# EAGLE design Schaltplan (EAGLE 6.6.0)
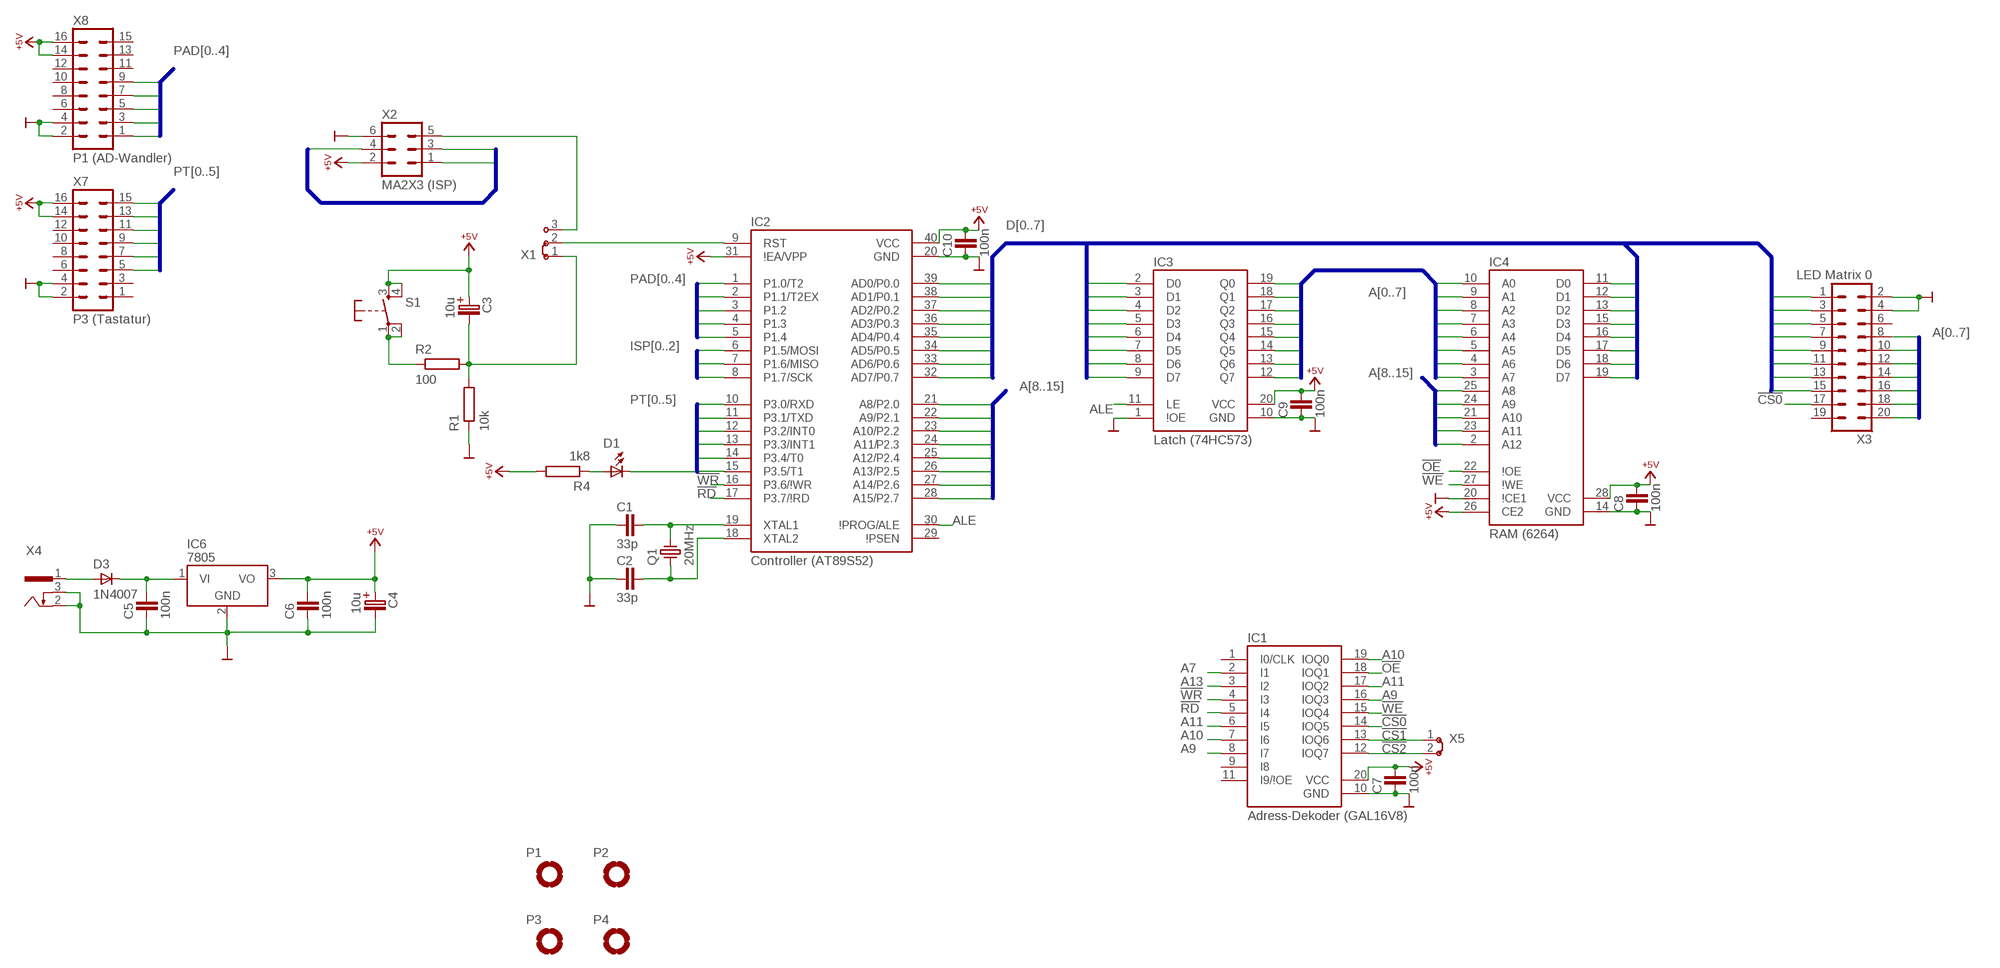
[diagram p0: schematic, sheet 1]

## Parts
C1  33p  C-2,5  [C-2,5]
C2  33p  C-2,5  [C-2,5]
C3  10u  ELKO-2,5  [ELKO-2,5]
C4  10u  ELKO-2,5  [ELKO-2,5]
C5  100n  C-2,5  [C-2,5]
C6  100n  C-2,5  [C-2,5]
C7  100n  C-2,5  [C-2,5]
C8  100n  C-2,5  [C-2,5]
C9  100n  C-2,5  [C-2,5]
C10  100n  C-2,5  [C-2,5]
D1  LED3-2,5  [LED3-2,5]
D3  1N4007  1N4007-10  [DO41-10]
IC1  Adress-Dekoder (GAL16V8)  16V8  [DIL20]
IC2  Controller (AT89S52)  AT89S52  [DIL40]
IC3  Latch (74HC573)  74573  [DIL20]
IC4  RAM (6264)  6264  [DIL28]
IC6  7805  [TO220V]
P1  MPAD-3,0  [MPAD-3,0]
P2  MPAD-3,0  [MPAD-3,0]
P3  MPAD-3,0  [MPAD-3,0]
P4  MPAD-3,0  [MPAD-3,0]
Q1  20MHz  Q-HC49U  [HC49U]
R1  10k  R-10  [R-10]
R2  100  R-10  [R-10]
R4  1k8  R-10  [R-10]
S1  KEY-3301  [T3301]
X1  J1X3  [J1X3]
X2  MA2X3 (ISP)  MA3X2  [MA3X2]
X3  LED Matrix 0  MA10X2  [MA10X2]
X4  PWRCON-HEBW21  [HEBW21]
X5  J1X2  [J1X2]
X7  P3 (Tastatur)  MA8X2  [MA8X2]
X8  P1 (AD-Wandler)  MA8X2  [MA8X2]

## Nets
!CS0: IC1.14(IOQ5) X3.17
!CS1: IC1.13(IOQ6) X5.1
!CS2: IC1.12(IOQ7) X5.2
!OE: IC1.18(IOQ1) IC4.22(\!OE)
!RD: IC1.5(I4) IC2.17(P3.7)
!WE: IC1.15(IOQ4) IC4.27(\!WE)
!WR: IC1.4(I3) IC2.16(P3.6)
+5V: C3.+ C4.+ C6.2 C7.2 C8.2 C9.2 C10.2 IC1.20(VCC) IC2.31(\!EA) IC2.40(VCC) IC3.20(VCC) IC4.26(CE2) IC4.28(VCC) IC6.3(VO) R4.2 S1.3(S) S1.4(S) X2.2 X7.14 X7.16 X8.14 X8.16
A0: IC3.19(Q0) IC4.10(A0) X3.8
A1: IC3.18(Q1) IC4.9(A1) X3.10
A2: IC3.17(Q2) IC4.8(A2) X3.12
A3: IC3.16(Q3) IC4.7(A3) X3.14
A4: IC3.15(Q4) IC4.6(A4) X3.16
A5: IC3.14(Q5) IC4.5(A5) X3.18
A6: IC3.13(Q6) IC4.4(A6) X3.20
A7: IC1.2(I1) IC3.12(Q7) IC4.3(A7)
A8: IC2.21(P2.0) IC4.25(A8)
A9: IC1.8(I7) IC1.16(IOQ3) IC2.22(P2.1) IC4.24(A9)
A10: IC1.7(I6) IC1.19(IOQ0) IC2.23(P2.2) IC4.21(A10)
A11: IC1.6(I5) IC1.17(IOQ2) IC2.24(P2.3) IC4.23(A11)
A12: IC2.25(P2.4) IC4.2(A12)
A13: IC1.3(I2) IC2.26(P2.5)
A14: IC2.27(P2.6)
A15: IC2.28(P2.7)
ALE: IC2.30(ALE) IC3.11(LE)
D0: IC2.39(P0.0) IC3.2(D0) IC4.11(D0) X3.1
D1: IC2.38(P0.1) IC3.3(D1) IC4.12(D1) X3.3
D2: IC2.37(P0.2) IC3.4(D2) IC4.13(D2) X3.5
D3: IC2.36(P0.3) IC3.5(D3) IC4.15(D3) X3.7
D4: IC2.35(P0.4) IC3.6(D4) IC4.16(D4) X3.9
D5: IC2.34(P0.5) IC3.7(D5) IC4.17(D5) X3.11
D6: IC2.33(P0.6) IC3.8(D6) IC4.18(D6) X3.13
D7: IC2.32(P0.7) IC3.9(D7) IC4.19(D7) X3.15
GND: C1.1 C2.1 C4.- C5.1 C6.1 C7.1 C8.1 C9.1 C10.1 IC1.10(GND) IC2.20(GND) IC3.1(\!OE) IC3.10(GND) IC4.14(GND) IC4.20(\!CE1) IC6.2(GND) R1.1 X2.6 X3.2 X3.4 X4.2 X4.3 X7.2 X7.4 X8.2 X8.4
ISP0: IC2.6(P1.5) X2.4
ISP1: IC2.7(P1.6) X2.1
ISP2: IC2.8(P1.7) X2.3
N$1: D1.A R4.1
N$8: IC2.9(RST) X1.2
N$9: C1.2 IC2.19(XTAL1) Q1.2
N$10: C2.2 IC2.18(XTAL2) Q1.1
N$12: D3.A X4.1
N$13: C5.2 D3.C IC6.1(VI)
N$15: X1.3 X2.5
N$16: C3.- R1.2 R2.2 X1.1
N$18: R2.1 S1.1(P) S1.2(P)
PAD0: IC2.1(P1.0) X8.9
PAD1: IC2.2(P1.1) X8.7
PAD2: IC2.3(P1.2) X8.5
PAD3: IC2.4(P1.3) X8.3
PAD4: IC2.5(P1.4) X8.1
PT0: IC2.10(P3.0) X7.15
PT1: IC2.11(P3.1) X7.13
PT2: IC2.12(P3.2) X7.11
PT3: IC2.13(P3.3) X7.9
PT4: IC2.14(P3.4) X7.7
PT5: D1.C IC2.15(P3.5) X7.5
Unconnected: IC1.1(I0/CLK) IC1.9(I8) IC1.11(I9/\!OE) IC2.29(\!PSEN) P1.B3,0(MOUNT) P2.B3,0(MOUNT) P3.B3,0(MOUNT) P4.B3,0(MOUNT) X3.6 X3.19 X7.1 X7.3 X7.6 X7.8 X7.10 X7.12 X8.6 X8.8 X8.10 X8.11 X8.12 X8.13 X8.15

## Buses
A[0..7]
A[8..15]
D[0..7]
PAD[0..4]
PT[0..5]
ISP[0..2]

## Library data of the parts
C1 C2 C5-C10 = 89S52mini:C-2,5
C3 C4 = 89S52mini:ELKO-2,5
D1 = 89S52mini:LED3-2,5
D3 = 89S52mini:1N4007-10
IC1 = 89S52mini:16V8
IC2 = 89S52mini:AT89S52
IC3 = 89S52mini:74573
IC4 = 89S52mini:6264
IC6 = 89S52mini:7805
P1-P4 = 89S52mini:MPAD-3,0
Q1 = 89S52mini:Q-HC49U
R1 R2 R4 = 89S52mini:R-10
S1 = 89S52mini:KEY-3301
X1 = 89S52mini:J1X3
X2 = 89S52mini:MA3X2
X3 = 89S52mini:MA10X2
X4 = 89S52mini:PWRCON-HEBW21
X5 = 89S52mini:J1X2
X7 X8 = 89S52mini:MA8X2

## Board
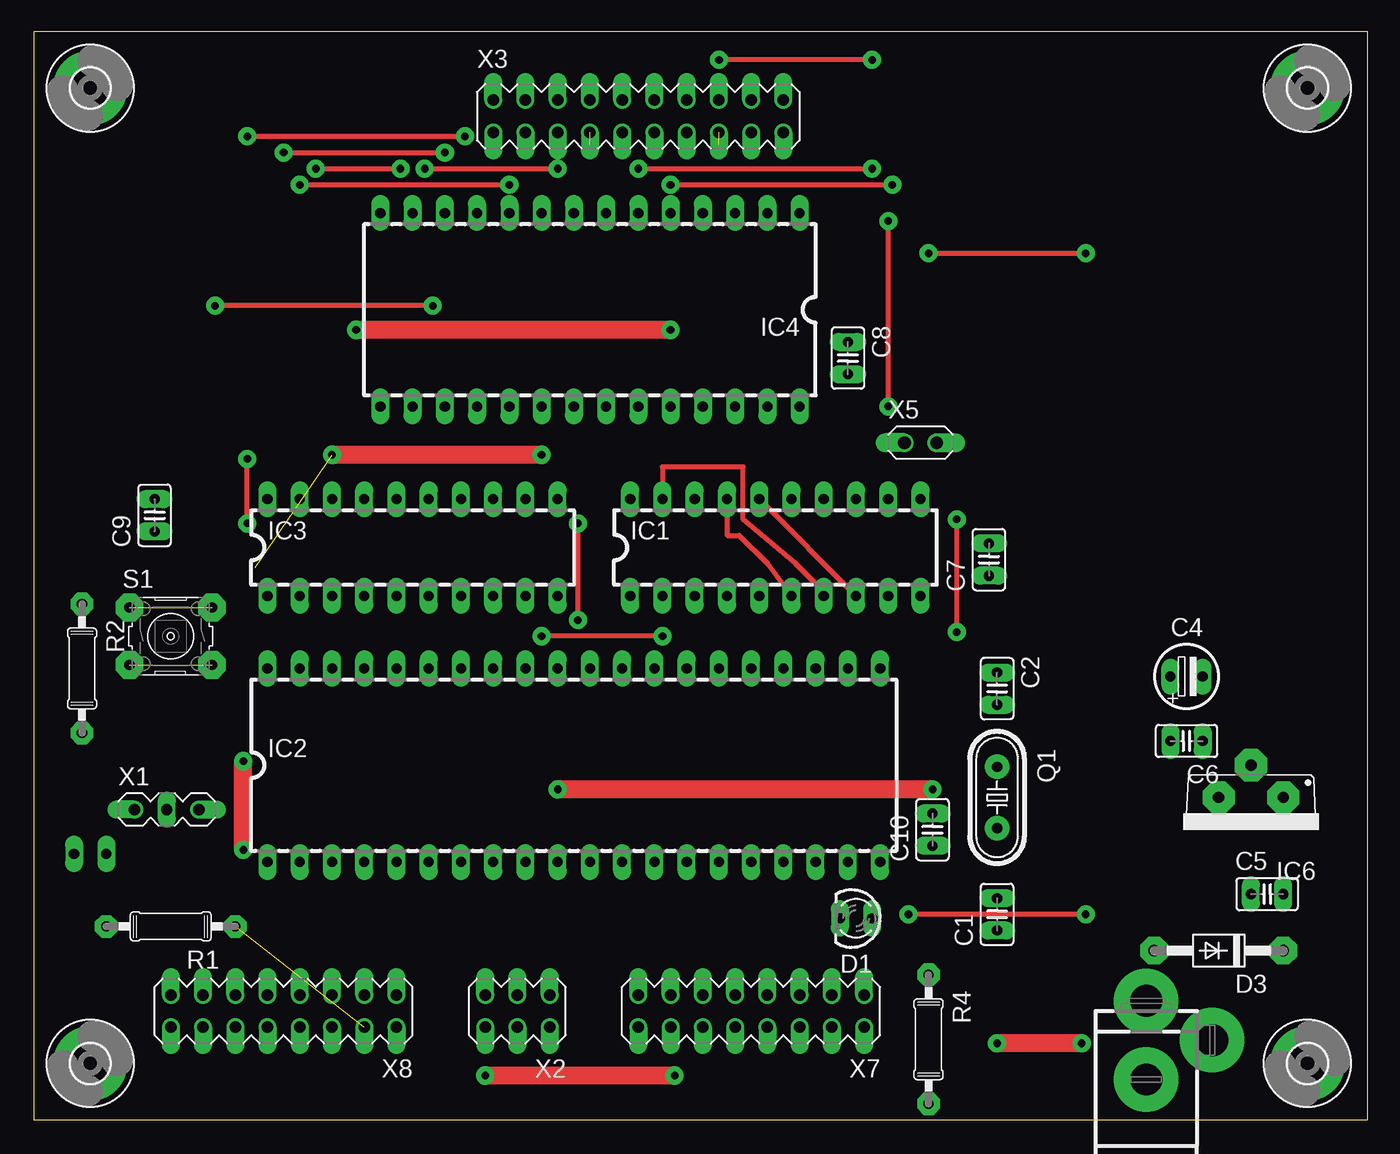
[diagram p1: board, top side]
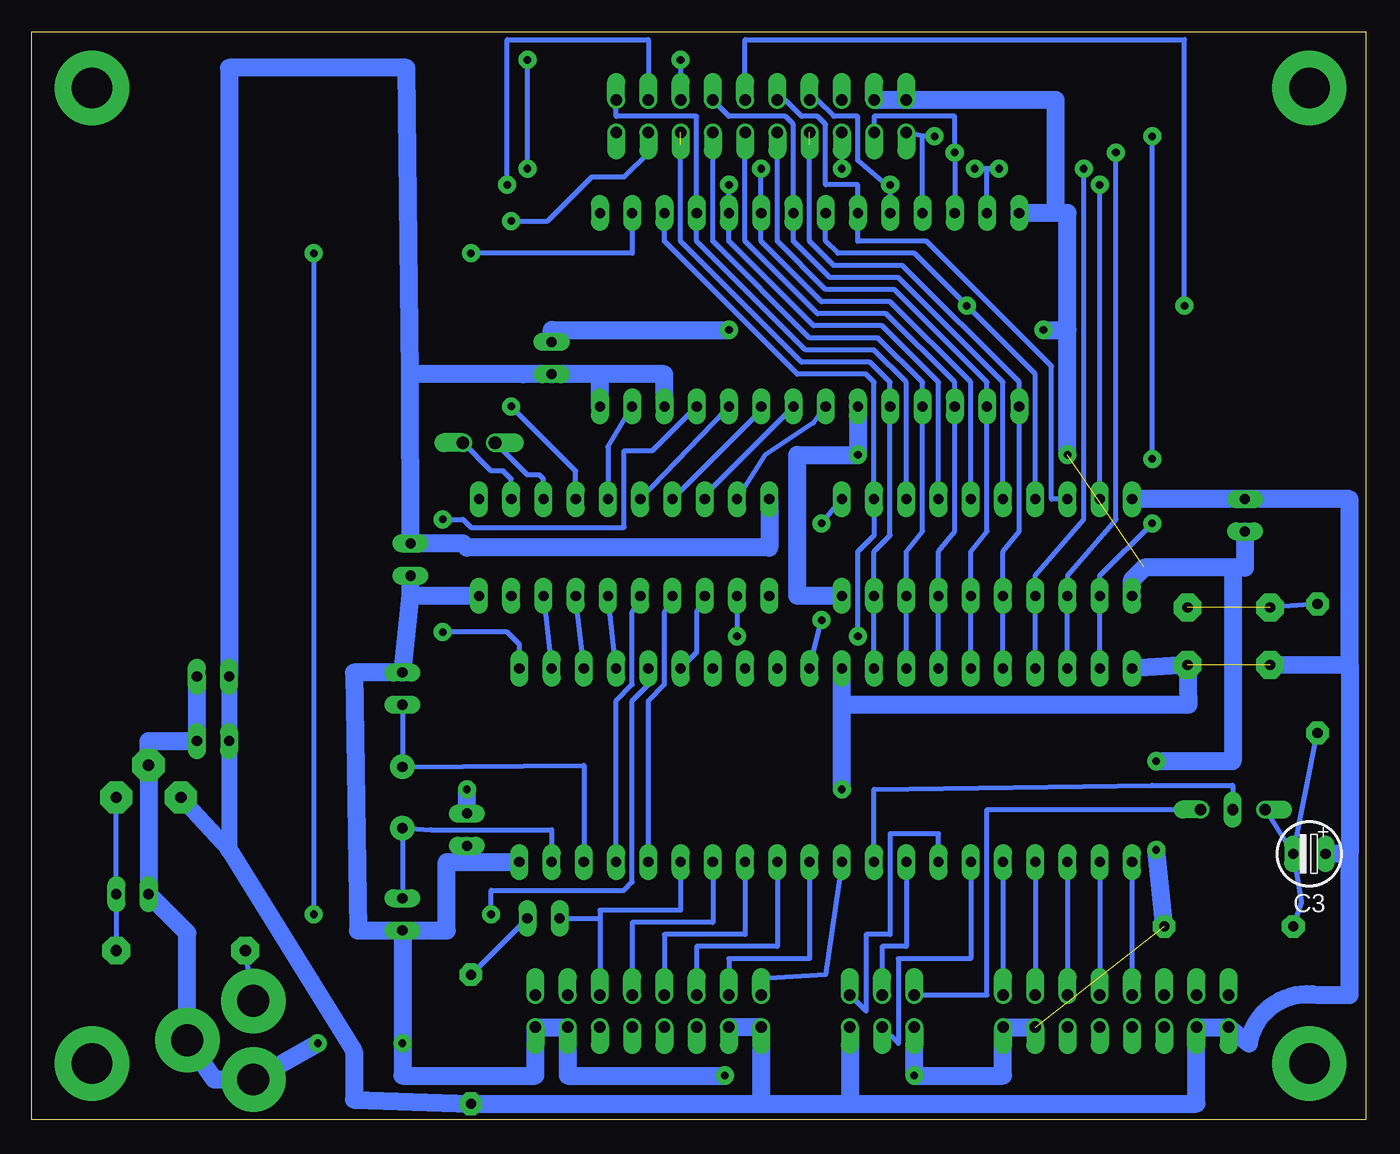
[diagram p2: board, bottom side, seen from below]

Size 105.08 x 85.72 mm. Coordinates in mm from the lower left corner, seen from the top.
Outline: 0,0 105.08,0 105.08,85.72 0,85.72 0,0
Copper layers (1*16): Top 0.035mm / dielectric 1.5mm / Bottom 0.035mm
Design rules "default *": minimum track width 16mil, minimum drill 16mil, track to track 14mil, track to pad 14mil, pad to pad 14mil, via to via 14mil, smd to smd 8mil, copper to edge 10mil, drill to drill 24mil, minimum pad ring 10mil, minimum via ring 8mil, stop-mask expansion 4mil, vias tented up to drill 0mil, thermal gap 10mil

### Footprints (pad centres in the part's own frame; a part is rotated, then mirrored left to right if it is on the bottom)
C-2,5 = drill 0.8 pad 1.422 long: 1 -1.27,0; 2 1.27,0
ELKO-2,5 = drill 0.8 pad 1.422 long: + -1.27,0; - 1.27,0
LED3-2,5 = drill 0.8 pad 1.422 long: A -1.27,0; C 1.27,0
DO41-10 = drill 0.9 pad 2.184 octagon: A 5.08,0; C -5.08,0
DIL20 = drill 0.8 pad 1.422 long: 1 -11.43,-3.81; 2 -8.89,-3.81; 3 -6.35,-3.81; 4 -3.81,-3.81; 5 -1.27,-3.81; 6 1.27,-3.81; 7 3.81,-3.81; 8 6.35,-3.81; 9 8.89,-3.81; 10 11.43,-3.81; 11 11.43,3.81; 12 8.89,3.81; 13 6.35,3.81; 14 3.81,3.81; 15 1.27,3.81; 16 -1.27,3.81; 17 -3.81,3.81; 18 -6.35,3.81; 19 -8.89,3.81; 20 -11.43,3.81
DIL40 = drill 0.8 pad 1.422 long: 1 -24.13,-7.62; 2 -21.59,-7.62; 3 -19.05,-7.62; 4 -16.51,-7.62; 5 -13.97,-7.62; 6 -11.43,-7.62; 7 -8.89,-7.62; 8 -6.35,-7.62; 9 -3.81,-7.62; 10 -1.27,-7.62; 11 1.27,-7.62; 12 3.81,-7.62; 13 6.35,-7.62; 14 8.89,-7.62; 15 11.43,-7.62; 16 13.97,-7.62; 17 16.51,-7.62; 18 19.05,-7.62; 19 21.59,-7.62; 20 24.13,-7.62; 21 24.13,7.62; 22 21.59,7.62; 23 19.05,7.62; 24 16.51,7.62; 25 13.97,7.62; 26 11.43,7.62; 27 8.89,7.62; 28 6.35,7.62; 29 3.81,7.62; 30 1.27,7.62; 31 -1.27,7.62; 32 -3.81,7.62; 33 -6.35,7.62; 34 -8.89,7.62; 35 -11.43,7.62; 36 -13.97,7.62; 37 -16.51,7.62; 38 -19.05,7.62; 39 -21.59,7.62; 40 -24.13,7.62
DIL28 = drill 0.8 pad 1.422 long: 1 -16.51,-7.62; 2 -13.97,-7.62; 3 -11.43,-7.62; 4 -8.89,-7.62; 5 -6.35,-7.62; 6 -3.81,-7.62; 7 -1.27,-7.62; 8 1.27,-7.62; 9 3.81,-7.62; 10 6.35,-7.62; 11 8.89,-7.62; 12 11.43,-7.62; 13 13.97,-7.62; 14 16.51,-7.62; 15 16.51,7.62; 16 13.97,7.62; 17 11.43,7.62; 18 8.89,7.62; 19 6.35,7.62; 20 3.81,7.62; 21 1.27,7.62; 22 -1.27,7.62; 23 -3.81,7.62; 24 -6.35,7.62; 25 -8.89,7.62; 26 -11.43,7.62; 27 -13.97,7.62; 28 -16.51,7.62
TO220V = drill 0.9 pad 2.54 octagon: 1 -2.54,0; 2 0,-2.54; 3 2.54,0
MPAD-3,0 = drill 3.2 pad 5.842: B3,0 0,0
HC49U = drill 0.8 pad 1.93: 1 -2.413,0; 2 2.413,0
R-10 = drill 0.8 pad 1.778 octagon: 1 -5.08,0; 2 5.08,0
T3301 = drill 0.8 pad 2.184 octagon: 1 -3.251,2.261; 2 3.251,2.261; 3 -3.251,-2.261; 4 3.251,-2.261
J1X3 = drill 0.9 pad 1.422 offset: 1 -2.54,0; 3 2.54,0 | drill 0.9 pad 1.422 long: 2 0,0
MA3X2 = drill 0.9 pad 1.422 offset: 1 -2.54,-1.27; 2 -2.54,1.27; 3 0,-1.27; 4 0,1.27; 5 2.54,-1.27; 6 2.54,1.27
MA10X2 = drill 0.9 pad 1.422 offset: 1 -11.43,-1.27; 2 -11.43,1.27; 3 -8.89,-1.27; 4 -8.89,1.27; 5 -6.35,-1.27; 6 -6.35,1.27; 7 -3.81,-1.27; 8 -3.81,1.27; 9 -1.27,-1.27; 10 -1.27,1.27; 11 1.27,-1.27; 12 1.27,1.27; 13 3.81,-1.27; 14 3.81,1.27; 15 6.35,-1.27; 16 6.35,1.27; 17 8.89,-1.27; 18 8.89,1.27; 19 11.43,-1.27; 20 11.43,1.27
HEBW21 = drill 2.5 pad 5.08: 1 6.2,0; 2 3.1,-5.2; 3 0,0
J1X2 = drill 1 pad 1.422 offset: 1 -1.27,0; 2 1.27,0
MA8X2 = drill 0.9 pad 1.422 offset: 1 -8.89,-1.27; 2 -8.89,1.27; 3 -6.35,-1.27; 4 -6.35,1.27; 5 -3.81,-1.27; 6 -3.81,1.27; 7 -1.27,-1.27; 8 -1.27,1.27; 9 1.27,-1.27; 10 1.27,1.27; 11 3.81,-1.27; 12 3.81,1.27; 13 6.35,-1.27; 14 6.35,1.27; 15 8.89,-1.27; 16 8.89,1.27

### Placement (x,y rotation side)
C1  75.88,16.19 90 top
C2  75.88,33.97 270 top
C3  4.45,20.95 180 bottom
C4  90.81,34.92 0 top
C5  97.16,17.78 0 top
C6  90.81,29.84 180 top
C7  75.25,44.13 90 top
C8  64.14,60.01 270 top
C9  9.53,47.62 90 top
C10  70.8,22.86 90 top
D1  64.77,15.88 180 top
D3  93.34,13.34 180 top
IC1  58.42,45.09 0 top
IC2  42.55,27.94 0 top
IC3  29.84,45.09 0 top
IC4  43.81,63.82 180 top
IC6  95.89,25.4 180 top
P1  4.45,4.45 0 top
P2  100.33,4.45 0 top
P3  100.33,81.28 0 top
P4  4.45,81.28 0 top
Q1  75.88,25.4 270 top
R1  10.79,15.24 180 top
R2  3.81,35.56 270 top
R4  70.48,6.35 270 top
S1  10.79,38.1 0 top
X1  10.48,24.45 0 top
X2  38.1,8.57 180 top
X3  47.62,79.06 0 top
X4  87.63,3.17 90 top
X5  69.85,53.34 0 top
X7  56.52,8.57 180 top
X8  19.68,8.57 180 top

### Tracks (layer width: path | path; a pad name or v marks a point on that pad's centre or on a via)
!CS0  (via drill 0.6 pad 1.42)
  Top 0.406: v67.31,56.2 v67.31,70.8
  Bottom 0.406: IC1.14 62.23,51.12 v67.31,56.2 | v67.31,70.8 64.45,70.8 60.96,74.3 58.42,74.3 56.52,76.2 X3.17
!CS1
  Bottom 0.406: IC1.13 64.77,50.48 65.09,50.8 66.04,50.8 X5.1
!CS2
  Bottom 0.406: IC1.12 67.31,50.48 67.94,51.12 68.9,51.12 X5.2
!OE
  Bottom 0.406: IC1.18 51.44,49.85 IC4.22
!RD
  Bottom 0.406: IC2.17 59.05,33.02 57.78,34.29 57.78,40.01 IC1.5
!WE
  Bottom 0.406: IC4.27 59.69,53.02 IC1.15
!WR
  Bottom 0.406: IC2.16 56.52,33.02 55.24,34.29 55.24,40.01 IC1.4
+5V  (via drill 0.6 pad 1.42)  (1 unrouted)
  Top 1.422: v70.8,26.04 v41.27,26.04
  Bottom 1.27: C4.+ C6.2 89.53,21.27 IC6.3
  Bottom 1.422: 47.62,1.27 X7.16 X7.14 | 47.62,1.27 40.64,1.27 | 40.64,1.27 13.34,1.27 X8.14 X8.16 9.21,6.03 arc90 3.81,9.84 1.27,9.84 1.27,20.95 | X2.2 40.64,1.27 | S1.3 1.27,35.88 | 1.27,35.88 1.27,20.95 | 1.27,20.95 C3.+ | 47.62,1.27 R4.2 79.69,1.59 79.69,5.4 89.53,21.27 | IC2.40 S1.4 13.97,32.7 41.27,32.7 | 41.27,32.7 IC2.31 | 75.28,58.74 C7.2 71.12,45.4 70.8,45.09 46.99,45.09 IC1.20 | 75.28,58.74 75.56,82.87 89.53,82.87 C4.+ | IC4.26 55.24,58.74 60.33,58.74 | IC4.28 60.33,58.74 | 60.33,58.74 66.36,58.74 | 66.36,58.74 75.28,58.74 | 1.27,35.88 1.27,48.9 C9.2 IC3.20 | C8.2 66.36,58.74 | 66.36,58.74 | C10.2 v70.8,26.04 | v41.27,26.04 41.27,32.7
A0  (via drill 0.6 pad 1.42)
  Top 0.406: v20.95,73.66 v37.47,73.66
  Bottom 0.406: IC3.19 v20.95,73.66 | IC4.10 v37.47,73.66 37.78,73.66 40.01,75.56 40.01,79.06 41.91,79.06 43.18,80.33 X3.8
A1
  Bottom 0.406: IC3.18 24.77,48.9 24.77,59.37 34.61,69.22 40.01,69.22 IC4.9 40.01,73.66 42.55,73.66 42.55,78.42 43.18,79.06 44.45,79.06 45.72,80.33 X3.10
A2  (via drill 0.6 pad 1.42)
  Top 0.406: v31.43,64.14 v14.29,64.14
  Bottom 0.406: IC4.8 42.55,69.22 41.59,68.26 35.56,68.26 v31.43,64.14 26.04,58.74 IC3.17 | X3.12 48.9,85.09 14.29,85.09 v14.29,64.14
A3
  Bottom 0.406: IC3.16 28.57,58.1 36.83,66.36 42.23,66.36 45.09,69.22 IC4.7 45.09,78.42 45.72,79.06 50.16,79.06 X3.14
A4  (via drill 0.6 pad 1.42)
  Top 0.406: v47.62,74.93 v66.04,74.93 | v66.04,83.5 v53.98,83.5
  Bottom 0.406: IC3.15 31.11,58.1 37.47,64.45 42.86,64.45 47.62,69.22 IC4.6 v47.62,74.93 | v66.04,74.93 v66.04,83.5 | v53.98,83.5 X3.16
A5  (via drill 0.6 pad 1.42)
  Top 0.406: v50.16,73.66 v67.63,73.66
  Bottom 0.406: IC3.14 33.66,58.1 38.1,62.55 43.5,62.55 50.16,69.22 IC4.5 v50.16,73.66 | v67.63,73.66 67.63,85.09 56.52,85.09 X3.18
A6
  Bottom 0.406: IC3.13 36.2,58.1 38.73,60.64 44.13,60.64 52.7,69.22 IC4.4 52.7,79.06 59.05,79.06 X3.20
A7  (via drill 0.6 pad 1.42)
  Top 0.406: v49.53,38.1 v40.01,38.1
  Bottom 0.406: IC4.3 55.24,69.22 44.77,58.74 39.37,58.74 38.73,58.1 IC3.12 38.73,46.04 40.01,44.77 v40.01,38.1 | IC1.2 v49.53,38.1
A8  (via drill 0.6 pad 1.42)
  Top 0.406: v72.71,38.42 v72.71,47.31
  Bottom 0.406: IC4.25 56.2,52.7 58.42,52.7 58.42,46.67 70.48,46.67 71.12,47.31 v72.71,47.31 | IC2.21 66.67,37.47 67.63,38.42 v72.71,38.42
A9
  Top 0.406: IC1.16 IC1.8
  Bottom 0.406: IC4.24 50.48,55.88 IC1.16 | IC1.8 IC2.22
A10
  Top 0.406: IC1.7 62.23,41.59 60.01,43.81 55.88,47.31 55.88,51.44 49.53,51.44 IC1.19
  Bottom 0.406: IC4.21 43.5,54.93 47.31,52.39 IC1.19 | IC2.23 IC1.7
A11
  Top 0.406: IC1.17 54.61,46.04 55.56,46.04 57.78,43.81 IC1.6
  Bottom 0.406: IC2.24 IC1.6 | IC4.23 47.62,55.88 IC1.17
A12  (via drill 0.6 pad 1.42)
  Top 0.406: v70.48,68.26 v82.87,68.26 | v82.87,16.19 v68.9,16.19
  Bottom 0.406: IC4.2 57.78,68.26 v70.48,68.26 | v82.87,68.26 v82.87,16.19 | v68.9,16.19 68.9,18.1 58.42,18.1 57.78,18.73 57.78,33.02 56.52,34.29 IC2.25
A13
  Bottom 0.406: IC1.3 52.7,40.01 52.7,36.83 IC2.26
ALE  (via drill 0.6 pad 1.42)
  Top 0.406: v42.86,39.37 v42.86,46.99
  Bottom 0.406: IC2.30 v42.86,39.37 | v42.86,46.99 IC3.11
D0  (via drill 0.6 pad 1.42)
  Top 0.406: v16.83,46.99 v16.83,52.07 | v16.83,77.47 v33.97,77.47
  Bottom 0.406: IC2.39 IC3.2 20.95,42.86 v16.83,46.99 | 34.92,77.47 X3.1 | IC4.11 34.92,77.47 | v16.83,52.07 v16.83,77.47 | v33.97,77.47 34.92,77.47
D1  (via drill 0.6 pad 1.42)
  Top 0.406: v19.68,76.2 v32.38,76.2
  Bottom 0.406: IC2.38 IC3.3 23.5,42.86 19.68,47.31 v19.68,76.2 | IC4.12 v32.38,76.2 32.38,79.06 38.73,79.06 X3.3
D2  (via drill 0.6 pad 1.42)
  Top 0.406: v22.23,74.93 v28.89,74.93 | v30.8,74.93 v41.27,74.93
  Bottom 0.406: IC2.37 IC3.4 26.04,42.86 22.23,47.31 v22.23,74.93 | IC4.13 29.84,74.93 v28.89,74.93 v30.8,74.93 | v41.27,74.93 X3.5
D3  (1 unrouted)
  Bottom 0.406: IC2.36 IC3.5 28.57,44.77 27.3,46.35 IC4.15 27.3,58.1 36.51,67.31 41.91,67.31 43.81,69.22 43.81,76.83
D4
  Bottom 0.406: IC2.35 IC3.6 31.11,44.77 29.84,46.35 IC4.16 29.84,58.1 37.15,65.41 42.55,65.41 46.35,69.22 X3.9
D5
  Bottom 0.406: IC2.34 IC3.7 33.66,44.77 32.38,46.35 IC4.17 32.38,58.1 37.78,63.5 43.18,63.5 48.9,69.22 X3.11
D6
  Bottom 0.406: IC2.33 IC3.8 36.2,44.77 34.92,46.35 IC4.18 34.92,58.1 38.42,61.59 43.81,61.59 51.44,69.22 X3.13
D7  (1 unrouted)
  Bottom 0.406: IC2.32 IC3.9 38.73,44.77 37.47,46.04 IC4.19 37.47,58.1 39.05,59.69 44.45,59.69 53.98,69.22 53.98,76.83
GND  (via drill 0.6 pad 1.42)  (2 unrouted)
  Top 1.422: v82.55,6.03 v75.88,6.03 | v40.01,52.39 v23.5,52.39 | v50.16,62.23 v25.4,62.23 | v50.48,3.49 v35.56,3.49 | v16.51,21.27 v16.51,28.26
  Bottom 1.422: C4.- C6.1 95.89,29.84 IC6.2 C5.1 92.83,14.72 X4.2 90.68,3.17 X4.3 v82.55,6.03 | IC3.1 18.41,42.55 17.46,43.5 10.48,43.5 | IC3.10 44.77,41.27 44.77,52.39 v40.01,52.39 IC4.20 | C1.1 72.39,14.92 72.39,20.32 70.8,20.32 | 70.8,20.32 IC2.20 | C1.1 v75.88,6.03 75.88,3.49 65.41,3.49 X7.2 X7.4 62.87,3.49 v50.48,3.49 | C1.1 79.38,14.92 79.69,35.24 C2.1 75.25,41.27 | 10.48,43.5 9.53,43.5 C9.1 | v23.5,52.39 23.5,62.23 | 23.5,62.23 23.5,71.44 24.45,71.44 | 24.45,71.44 IC4.14 | IC1.10 75.25,41.27 | 75.25,41.27 C7.1 | C8.1 64.14,62.23 v50.16,62.23 | v25.4,62.23 23.5,62.23 | X3.4 X3.2 24.45,80.33 24.45,71.44 | X2.6 v35.56,3.49 28.57,3.49 X8.2 X8.4 | 10.48,43.5 10.48,28.26 v16.51,28.26 | R1.1 v16.51,21.27 | C10.1 70.8,20.32
ISP0
  Bottom 0.406: IC2.6 31.11,12.7 36.83,12.7 36.83,6.03 X2.4
ISP1
  Bottom 0.406: IC2.7 33.66,22.54 37.47,22.54 37.47,14.61 39.37,14.61 39.37,8.57 X2.1
ISP2
  Bottom 0.406: IC2.8 36.2,13.65 38.1,13.65 X2.3
N$1
  Bottom 0.406: R4.1 D1.A
N$8
  Bottom 0.406: IC2.9 38.73,26.04 16.83,26.35 10.48,26.35 X1.2
N$9
  Bottom 0.406: IC2.19 64.14,22.86 73.66,22.86 Q1.2 C1.2
N$10
  Bottom 0.406: IC2.18 61.59,27.94 Q1.1 C2.2
N$12
  Bottom 0.406: X4.1 87.8,10.64 D3.A
N$13
  Bottom 0.406: IC6.1 C5.2 D3.C
N$15
  Bottom 0.406: X2.5 29.84,9.84 29.84,24.45 X1.3
N$16
  Bottom 0.406: C3.- 5.08,17.14 R1.2 | X1.1 C3.- | C3.- R2.2
N$18  (1 unrouted)
  Bottom 0.406: R2.1 S1.1
PAD0
  Bottom 0.406: IC2.1 X8.9
PAD1
  Bottom 0.406: IC2.2 X8.7
PAD2
  Bottom 0.406: IC2.3 X8.5
PAD3
  Bottom 0.406: IC2.4 X8.3
PAD4
  Bottom 0.406: IC2.5 X8.1
PT0
  Bottom 0.406: IC2.10 42.55,11.43 47.62,11.11 X7.15
PT1
  Bottom 0.406: IC2.11 43.81,12.7 50.16,12.7 X7.13
PT2
  Bottom 0.406: IC2.12 46.35,13.65 52.7,13.65 X7.11
PT3
  Bottom 0.406: IC2.13 48.9,14.61 55.24,14.61 X7.9
PT4
  Bottom 0.406: IC2.14 51.44,15.56 57.78,15.56 X7.7
PT5
  Bottom 0.406: IC2.15 53.98,16.51 60.33,16.51 60.33,15.88 | 60.33,15.88 X7.5 | D1.C 60.33,15.88